# Altium schematic sheet MiCS_Sensors.SchDoc
size A4
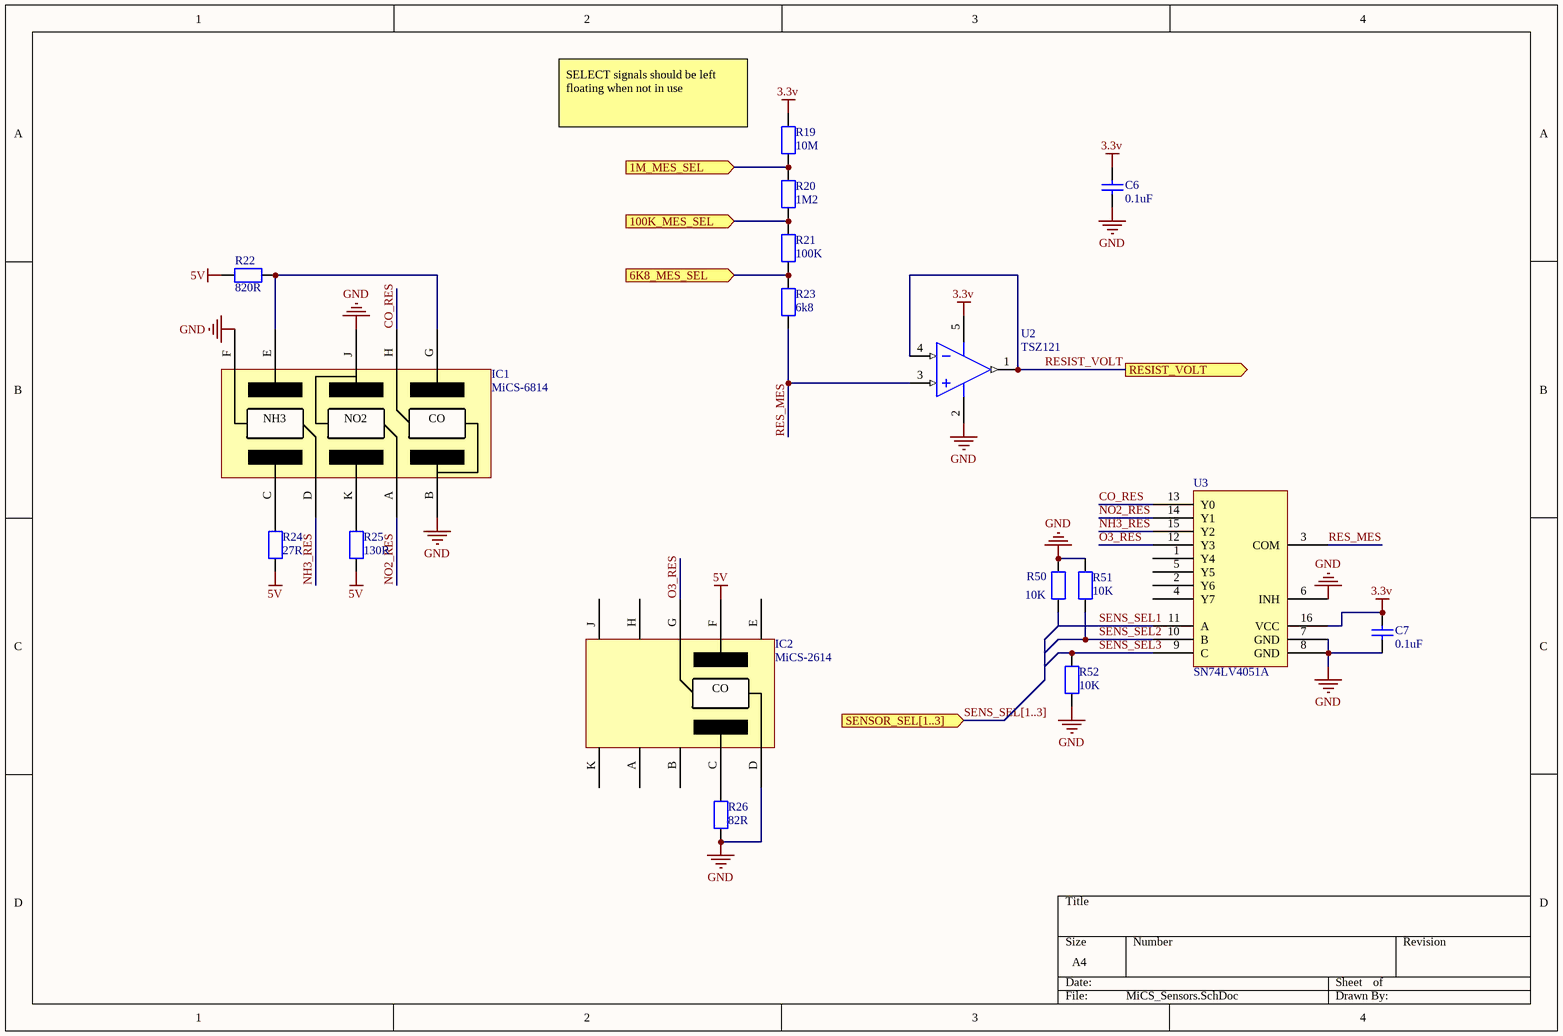
[diagram p0: MiCS_Sensors.SchDoc]

## Parts
C6  value 0.1uF  [0603_CAP]  (hidden comment: Capacitor)
C7  value 0.1uF  [0603_CAP]  (hidden comment: Capacitor)
IC1  MiCS-6814  [MiCS]
IC2  MiCS-2614  [MiCS]
R19  value 10M  [0603_RES]  (hidden comment: Resitor)
R20  value 1M2  [0603_RES]  (hidden comment: Resitor)
R21  value 100K  [0603_RES]  (hidden comment: Resitor)
R22  value 820R  [0603_RES]  (hidden comment: Resitor)
R23  value 6k8  [0603_RES]  (hidden comment: Resitor)
R24  value 27R  [0603_RES]  (hidden comment: Resitor)
R25  value 130R  [0603_RES]  (hidden comment: Resitor)
R26  value 82R  [0603_RES]  (hidden comment: Resitor)
R50  value 10K  [0603_RES]  (hidden comment: Resitor)
R51  value 10K  [0603_RES]  (hidden comment: Resitor)
R52  value 10K  [0603_RES]  (hidden comment: Resitor)
U2  TSZ121  [SOT95P280X145-5M]
U3  SN74LV4051A  [TSOP65P640X120-16M]

## Ports
1M_MES_SEL (in), 6K8_MES_SEL (in), 100K_MES_SEL (in), RESIST_VOLT (out), SENSOR_SEL[1..3] (in)

## Nets
3.3v: C6.2 C7.2 R19.2 U2.5(V+) U3.16(VCC)
5V: IC2.F R22.2 R24.1 R25.1
GND: C6.1 C7.1 IC1.B IC1.F IC1.J IC2.D R26.1 R50.2 R51.2 R52.1 U2.2(V-) U3.6(INH) U3.7(GND) U3.8(GND)
1M_MES_SEL: R19.1 R20.2 ; port 1M_MES_SEL
6K8_MES_SEL: R21.1 R23.2 ; port 6K8_MES_SEL
100K_MES_SEL: R20.1 R21.2 ; port 100K_MES_SEL
CO_RES: IC1.H U3.13(Y0)
NH3_RES: IC1.D U3.15(Y2)
NO2_RES: IC1.A U3.14(Y1)
O3_RES: IC2.G U3.12(Y3)
RES_MES: R23.1 U2.3(IN1+) U3.3(COM)
RESIST_VOLT: U2.1(OUT1) U2.4(IN1-) ; port RESIST_VOLT
SENS_SEL1: R50.1 U3.11(A)
SENS_SEL2: R51.1 U3.10(B)
SENS_SEL3: R52.2 U3.9(C)
NetIC1_C: IC1.C R24.2
NetIC1_E: IC1.E IC1.G R22.1
NetIC1_K: IC1.K R25.2
NetIC2_C: IC2.C R26.2

Not connected (* = marked no-connect by the designer): IC2 A B E H J K; U3 1(Y4) 2(Y6) 4(Y7) 5(Y5)

## Buses and harness runs
bus SENS_SEL[1..3] = port SENSOR_SEL[1..3]

## Notes on the sheet
- (near R19) SELECT signals should be left floating when not in use
- (in symbol MiCS-5524) CO
- (in symbol MiCS-6814) NH3; NO2; CO

## Library data of the parts
C6 C7 = Capacitor: Max_V: 25V
IC2 = MiCS-5524
U3 = SN74LV4051A: Analog Multiplexer/Demultiplexer; ComponentLink1URL: http://www.ti.com.cn/cn/lit/ds/symlink/sn74lv4051a.pdf; ComponentLink1Description: Datasheet